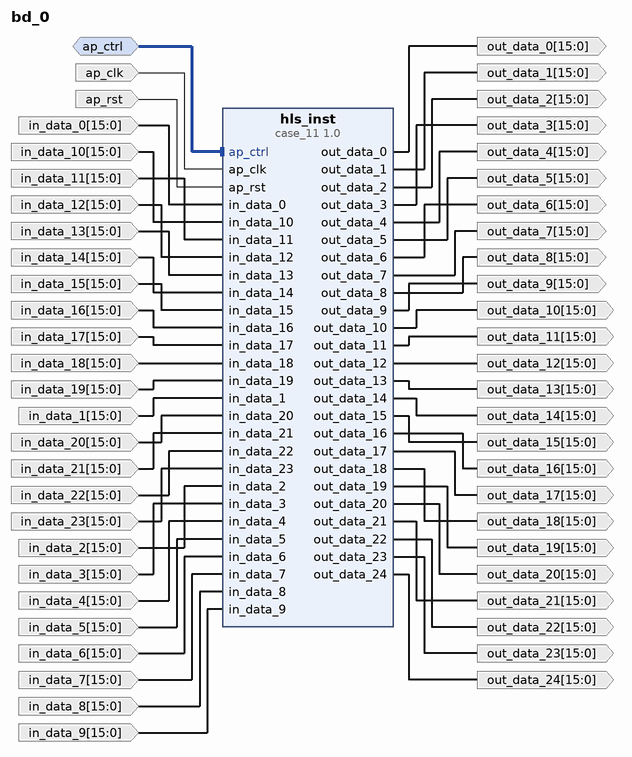
[diagram p0: block diagram of the top level]
# Vivado block design bd_0, xc7z020clg484-1, Vivado 2025.1
create_bd_design bd_0

create_bd_intf_port -mode Slave -vlnv xilinx.com:interface:acc_handshake_rtl:1.0 ap_ctrl
create_bd_port -dir I -type clk ap_clk
set_property -dict {CONFIG.FREQ_HZ 100000000.0} [get_bd_ports ap_clk]
create_bd_port -dir I -type rst ap_rst
set_property -dict {CONFIG.POLARITY ACTIVE_HIGH} [get_bd_ports ap_rst]
create_bd_port -dir I -from 15 -to 0 -type data in_data_0
create_bd_port -dir I -from 15 -to 0 -type data in_data_1
create_bd_port -dir I -from 15 -to 0 -type data in_data_10
create_bd_port -dir I -from 15 -to 0 -type data in_data_11
create_bd_port -dir I -from 15 -to 0 -type data in_data_12
create_bd_port -dir I -from 15 -to 0 -type data in_data_13
create_bd_port -dir I -from 15 -to 0 -type data in_data_14
create_bd_port -dir I -from 15 -to 0 -type data in_data_15
create_bd_port -dir I -from 15 -to 0 -type data in_data_16
create_bd_port -dir I -from 15 -to 0 -type data in_data_17
create_bd_port -dir I -from 15 -to 0 -type data in_data_18
create_bd_port -dir I -from 15 -to 0 -type data in_data_19
create_bd_port -dir I -from 15 -to 0 -type data in_data_2
create_bd_port -dir I -from 15 -to 0 -type data in_data_20
create_bd_port -dir I -from 15 -to 0 -type data in_data_21
create_bd_port -dir I -from 15 -to 0 -type data in_data_22
create_bd_port -dir I -from 15 -to 0 -type data in_data_23
create_bd_port -dir I -from 15 -to 0 -type data in_data_3
create_bd_port -dir I -from 15 -to 0 -type data in_data_4
create_bd_port -dir I -from 15 -to 0 -type data in_data_5
create_bd_port -dir I -from 15 -to 0 -type data in_data_6
create_bd_port -dir I -from 15 -to 0 -type data in_data_7
create_bd_port -dir I -from 15 -to 0 -type data in_data_8
create_bd_port -dir I -from 15 -to 0 -type data in_data_9
create_bd_port -dir O -from 15 -to 0 -type data out_data_0
create_bd_port -dir O -from 15 -to 0 -type data out_data_1
create_bd_port -dir O -from 15 -to 0 -type data out_data_10
create_bd_port -dir O -from 15 -to 0 -type data out_data_11
create_bd_port -dir O -from 15 -to 0 -type data out_data_12
create_bd_port -dir O -from 15 -to 0 -type data out_data_13
create_bd_port -dir O -from 15 -to 0 -type data out_data_14
create_bd_port -dir O -from 15 -to 0 -type data out_data_15
create_bd_port -dir O -from 15 -to 0 -type data out_data_16
create_bd_port -dir O -from 15 -to 0 -type data out_data_17
create_bd_port -dir O -from 15 -to 0 -type data out_data_18
create_bd_port -dir O -from 15 -to 0 -type data out_data_19
create_bd_port -dir O -from 15 -to 0 -type data out_data_2
create_bd_port -dir O -from 15 -to 0 -type data out_data_20
create_bd_port -dir O -from 15 -to 0 -type data out_data_21
create_bd_port -dir O -from 15 -to 0 -type data out_data_22
create_bd_port -dir O -from 15 -to 0 -type data out_data_23
create_bd_port -dir O -from 15 -to 0 -type data out_data_24
create_bd_port -dir O -from 15 -to 0 -type data out_data_3
create_bd_port -dir O -from 15 -to 0 -type data out_data_4
create_bd_port -dir O -from 15 -to 0 -type data out_data_5
create_bd_port -dir O -from 15 -to 0 -type data out_data_6
create_bd_port -dir O -from 15 -to 0 -type data out_data_7
create_bd_port -dir O -from 15 -to 0 -type data out_data_8
create_bd_port -dir O -from 15 -to 0 -type data out_data_9

create_bd_cell -type ip -vlnv xilinx.com:hls:case_11:1.0 hls_inst

# ---- connections ----

connect_bd_intf_net -intf_net ap_ctrl_0_1 [get_bd_intf_ports ap_ctrl] [get_bd_intf_pins hls_inst/ap_ctrl]
connect_bd_net -net ap_clk_0_1 [get_bd_ports ap_clk] [get_bd_pins hls_inst/ap_clk]
connect_bd_net -net ap_rst_0_1 [get_bd_ports ap_rst] [get_bd_pins hls_inst/ap_rst]
connect_bd_net [get_bd_pins hls_inst/out_data_0] [get_bd_ports out_data_0]
connect_bd_net [get_bd_pins hls_inst/out_data_1] [get_bd_ports out_data_1]
connect_bd_net [get_bd_pins hls_inst/out_data_2] [get_bd_ports out_data_2]
connect_bd_net [get_bd_pins hls_inst/out_data_3] [get_bd_ports out_data_3]
connect_bd_net [get_bd_pins hls_inst/out_data_4] [get_bd_ports out_data_4]
connect_bd_net [get_bd_pins hls_inst/out_data_5] [get_bd_ports out_data_5]
connect_bd_net [get_bd_pins hls_inst/out_data_6] [get_bd_ports out_data_6]
connect_bd_net [get_bd_pins hls_inst/out_data_7] [get_bd_ports out_data_7]
connect_bd_net [get_bd_pins hls_inst/out_data_8] [get_bd_ports out_data_8]
connect_bd_net [get_bd_pins hls_inst/out_data_9] [get_bd_ports out_data_9]
connect_bd_net [get_bd_pins hls_inst/out_data_10] [get_bd_ports out_data_10]
connect_bd_net [get_bd_pins hls_inst/out_data_11] [get_bd_ports out_data_11]
connect_bd_net [get_bd_pins hls_inst/out_data_12] [get_bd_ports out_data_12]
connect_bd_net [get_bd_pins hls_inst/out_data_13] [get_bd_ports out_data_13]
connect_bd_net [get_bd_pins hls_inst/out_data_14] [get_bd_ports out_data_14]
connect_bd_net [get_bd_pins hls_inst/out_data_15] [get_bd_ports out_data_15]
connect_bd_net [get_bd_pins hls_inst/out_data_16] [get_bd_ports out_data_16]
connect_bd_net [get_bd_pins hls_inst/out_data_17] [get_bd_ports out_data_17]
connect_bd_net [get_bd_pins hls_inst/out_data_18] [get_bd_ports out_data_18]
connect_bd_net [get_bd_pins hls_inst/out_data_19] [get_bd_ports out_data_19]
connect_bd_net [get_bd_pins hls_inst/out_data_20] [get_bd_ports out_data_20]
connect_bd_net [get_bd_pins hls_inst/out_data_21] [get_bd_ports out_data_21]
connect_bd_net [get_bd_pins hls_inst/out_data_22] [get_bd_ports out_data_22]
connect_bd_net [get_bd_pins hls_inst/out_data_23] [get_bd_ports out_data_23]
connect_bd_net [get_bd_pins hls_inst/out_data_24] [get_bd_ports out_data_24]
connect_bd_net -net in_data_0_0_1 [get_bd_ports in_data_0] [get_bd_pins hls_inst/in_data_0]
connect_bd_net -net in_data_10_0_1 [get_bd_ports in_data_10] [get_bd_pins hls_inst/in_data_10]
connect_bd_net -net in_data_11_0_1 [get_bd_ports in_data_11] [get_bd_pins hls_inst/in_data_11]
connect_bd_net -net in_data_12_0_1 [get_bd_ports in_data_12] [get_bd_pins hls_inst/in_data_12]
connect_bd_net -net in_data_13_0_1 [get_bd_ports in_data_13] [get_bd_pins hls_inst/in_data_13]
connect_bd_net -net in_data_14_0_1 [get_bd_ports in_data_14] [get_bd_pins hls_inst/in_data_14]
connect_bd_net -net in_data_15_0_1 [get_bd_ports in_data_15] [get_bd_pins hls_inst/in_data_15]
connect_bd_net -net in_data_16_0_1 [get_bd_ports in_data_16] [get_bd_pins hls_inst/in_data_16]
connect_bd_net -net in_data_17_0_1 [get_bd_ports in_data_17] [get_bd_pins hls_inst/in_data_17]
connect_bd_net -net in_data_18_0_1 [get_bd_ports in_data_18] [get_bd_pins hls_inst/in_data_18]
connect_bd_net -net in_data_19_0_1 [get_bd_ports in_data_19] [get_bd_pins hls_inst/in_data_19]
connect_bd_net -net in_data_1_0_1 [get_bd_ports in_data_1] [get_bd_pins hls_inst/in_data_1]
connect_bd_net -net in_data_20_0_1 [get_bd_ports in_data_20] [get_bd_pins hls_inst/in_data_20]
connect_bd_net -net in_data_21_0_1 [get_bd_ports in_data_21] [get_bd_pins hls_inst/in_data_21]
connect_bd_net -net in_data_22_0_1 [get_bd_ports in_data_22] [get_bd_pins hls_inst/in_data_22]
connect_bd_net -net in_data_23_0_1 [get_bd_ports in_data_23] [get_bd_pins hls_inst/in_data_23]
connect_bd_net -net in_data_2_0_1 [get_bd_ports in_data_2] [get_bd_pins hls_inst/in_data_2]
connect_bd_net -net in_data_3_0_1 [get_bd_ports in_data_3] [get_bd_pins hls_inst/in_data_3]
connect_bd_net -net in_data_4_0_1 [get_bd_ports in_data_4] [get_bd_pins hls_inst/in_data_4]
connect_bd_net -net in_data_5_0_1 [get_bd_ports in_data_5] [get_bd_pins hls_inst/in_data_5]
connect_bd_net -net in_data_6_0_1 [get_bd_ports in_data_6] [get_bd_pins hls_inst/in_data_6]
connect_bd_net -net in_data_7_0_1 [get_bd_ports in_data_7] [get_bd_pins hls_inst/in_data_7]
connect_bd_net -net in_data_8_0_1 [get_bd_ports in_data_8] [get_bd_pins hls_inst/in_data_8]
connect_bd_net -net in_data_9_0_1 [get_bd_ports in_data_9] [get_bd_pins hls_inst/in_data_9]

validate_bd_design
save_bd_design
